# Altium schematic sheet USB.SchDoc
size A4; SheetNumber: 3; SheetTotal: 9
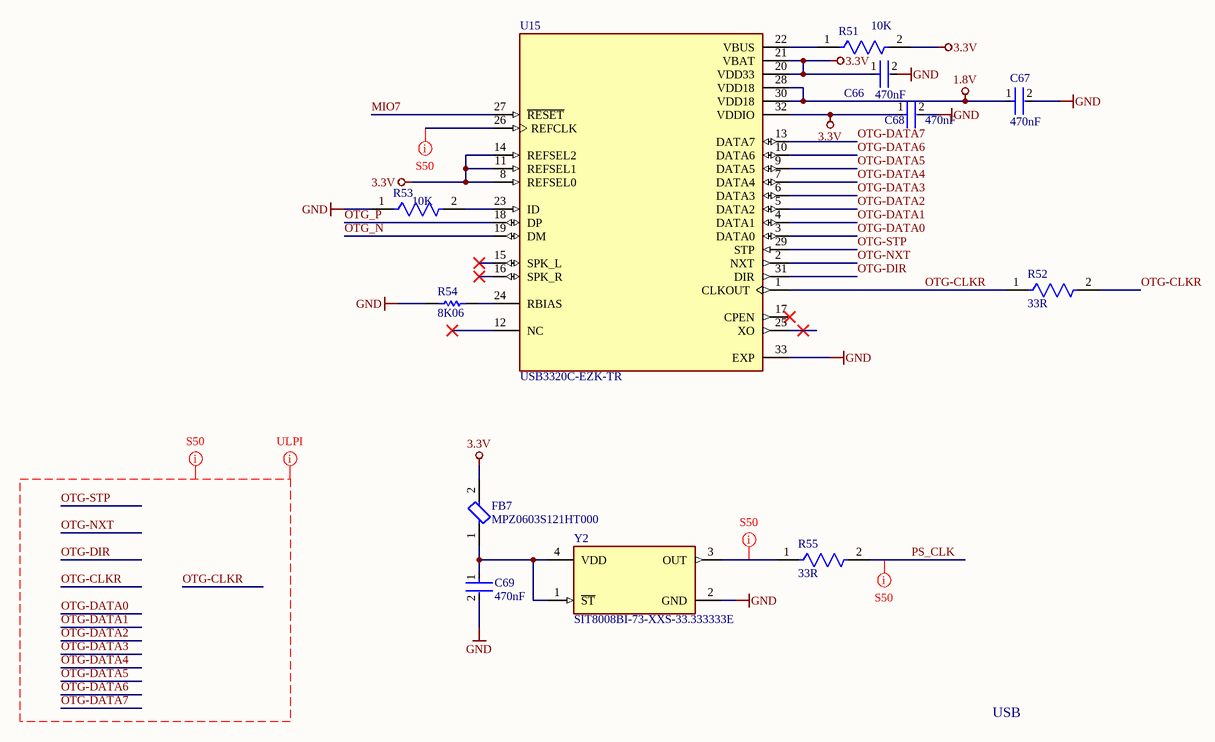
[diagram p0: USB.SchDoc]

## Parts
C66  470nF  [FP-GRM15-0_1-MFG]
C67  470nF  [FP-GRM15-0_1-MFG]
C68  470nF  [FP-GRM15-0_1-MFG]
C69  470nF  [FP-GRM15-0_1-MFG]
FB7  MPZ0603S121HT000  [FP-MPZ0603-IPC_C]
R51  10K  [FP-MCT0603-IPC_C]
R52  33R  [FP-AC0603-IPC_A]
R53  10K  [FP-MCT0603-IPC_C]
R54  8K06  [RESC0603(1608)_N]
R55  33R  [FP-AC0603-IPC_A]
U15  USB3320C-EZK-TR  [QFN50P500X500X100-33N]
Y2  SIT8008BI-73-XXS-33.333333E  [FP-SiT8008-7-MFG]

## Nets
1.8V: C67.1 U15.28(VDD18) U15.30(VDD18)
3.3V: C66.1 C68.1 FB7.2 R51.2 U15.8(REFSEL0) U15.11(REFSEL1) U15.14(REFSEL2) U15.20(VDD33) U15.21(VBAT) U15.32(VDDIO)
GND: C66.2 C67.2 C68.2 C69.2 R53.1 R54.1 U15.33(EXP) Y2.2(GND)
MIO7: U15.27(~{RESET})
OTG-CLKR: R52.1 R52.2 U15.1(CLKOUT)
OTG-DATA0: U15.3(DATA0)
OTG-DATA1: U15.4(DATA1)
OTG-DATA2: U15.5(DATA2)
OTG-DATA3: U15.6(DATA3)
OTG-DATA4: U15.7(DATA4)
OTG-DATA5: U15.9(DATA5)
OTG-DATA6: U15.10(DATA6)
OTG-DATA7: U15.13(DATA7)
OTG-DIR: U15.31(DIR)
OTG-NXT: U15.2(NXT)
OTG-STP: U15.29(STP)
OTG_N: U15.19(DM)
OTG_P: U15.18(DP)
PS_CLK: R55.2
NetC69_1: C69.1 FB7.1 Y2.1(~{ST}) Y2.4(VDD)
NetR51_1: R51.1 U15.22(VBUS)
NetR53_2: R53.2 U15.23(ID)
NetR54_2: R54.2 U15.24(RBIAS)
NetR55_1: R55.1 Y2.3(OUT)

Not connected (* = marked no-connect by the designer): U15 12(NC)* 15(SPK_L)* 16(SPK_R)* 17(CPEN)* 25(XO)* 26(REFCLK)

## Layout directives
mark named S50: NetR55_1, NetU15_26, OTG-CLKR, OTG-DATA0, OTG-DATA1, OTG-DATA2, OTG-DATA3, OTG-DATA4, OTG-DATA5, OTG-DATA6, OTG-DATA7, OTG-DIR, OTG-NXT, OTG-STP, PS_CLK
mark named ULPI: OTG-CLKR, OTG-DATA0, OTG-DATA1, OTG-DATA2, OTG-DATA3, OTG-DATA4, OTG-DATA5, OTG-DATA6, OTG-DATA7, OTG-DIR, OTG-NXT, OTG-STP

## Notes on the sheet
- USB

## Library data of the parts
C66-C69 = CMP-2000-05009-2: CAP CER 0.47UF 10V X5R 0402; Manufacturer: Murata Electronics North America; Manufacturer Part Number: GRM155R61A474KE15D; Temperature Coefficient: 15%; Material: Ceramic; Tolerance: 10%; Device Class L3: Ceramic Capacitors; ComponentLink2Description: Datasheet; ComponentLink2URL: https://search.murata.co.jp/Ceramy/image/img/A01X/G101/ENG/GRM155R61A474KE15-01A.pdf; Package: GRM15-0.1; Voltage Rating: 10V; Capacitance: 0.47uF; Category: Cap; Temperature Range High: +85°C; Temperature Range Low: -55°C; Height: 0.55mm; Device Class L2: Capacitors; Lead Free: Yes; Mouser Description: Multilayer Ceramic Capacitors MLCC - SMD/SMT 0402 0.47uF 10volts X5R 10%; Ipc Land Pattern Name: CAPC10050X50; Temperature Characteristic: X5R; Digikey Description: CAP CER 0.47UF 10V X5R 0402; Value: 0.47uF; Octopart: https://octopart.com/grm155r61a474ke15d-murata-196883; Automotive: No; Device Class L1: Passive Components; Temperature: -55°C to +85°C; RoHS: TRUE
FB7 = CMP-08257-000447-1: CHIP BEADS FOR GENERAL SIGNAL LI; Max Current Rating: 1A; DC Resistance (DCR): 130mR; Number of Lines: 1; Min Operating Temperature: -55°C; Mount: Surface Mount; Case Code (Imperial): 0201; Case Code (Metric): 0603; Max Operating Temperature: 125°C; RoHS Compliant: Yes; Packaging: Cut Tape; Case/Package: 0201
R51 R53 = CMP-02407-000775-1: RES SMD 100 OHM 1% 1/8W 0603
R52 R55 = CMP-03412-036690-2: RES 33Ω 1.00% 0.1W 0603; Power Rating: 100mW; Tolerance: 1%; Voltage Rating: 50V; Temperature Coefficient: 100ppm/°C; Case/Package: 0603; Ratings: AEC-Q200; Number of Terminations: 2; Case Code (Imperial): 0603; RoHS Compliant: Yes; Max Operating Temperature: 155°C; Packaging: Tape and Reel; Series: AC; Height: 0.45mm; Resistance: 33R; Features: Moisture Resistant; Case Code (Metric): 1608; Length: 1.6mm; Width: 0.8mm; Resistor Type: Thick Film; Max Power Dissipation: 100mW; Min Operating Temperature: -55°C; Termination: SMD/SMT
R54 = CMP-1012-00612-1: 8K06 0.1W 1% 0603 (1608 Metric)  SMD; Value: 8060.00 Ohm; Case-EIA: 0603; Case-Metric: 1608; Technology: SMT; Power: 0.1 W; Tolerance: 1 %
U15 = USB3320C-EZK-TR: Microchip USB3320C-EZK-TR, USB Transceiver, USB 2.0, 1.8 V, 3.3 V, 32-Pin QFN | Microchip Technology Inc. USB3320C-EZK-TR; SnapEDA_Link: https://www.snapeda.com/parts/USB3320C-EZK-TR/Microchip/view-part/?ref=snap; Package: QFN-32 Microchip; Value: *; MF: Microchip; MP: USB3320C-EZK-TR; Check_prices: https://www.snapeda.com/parts/USB3320C-EZK-TR/Microchip/view-part/?ref=eda
Y2 = CMP-25159-259459-1: MEMS OSC XO 33.333333MHZ H/LV-CM; Max Supply Current: 4.5mA; Frequency Stability: 50ppm; Packaging: Tape and Reel; Series: SIT8008B; Mount: Surface Mount; RoHS Compliant: Yes; Frequency: 33.333333MHz; Max Operating Temperature: 85°C; Case/Package: SMD/SMT; Min Operating Temperature: -40°C